# Altium schematic sheet 1_P1.schdoc
size 426 x 304 mm; Symbol: Sheet-Symbol_A3; Device: Sheet-Symbol_A3; Convert to PCB: yes; Add into BOM: yes; @Project Name: Catch5Yeah; @Page Count: 1; @Update Date: 2021-12-23; @Create Date: 2021-12-23; @Schematic Name: Schematic2; Company: 深圳嘉立创科技发展有限公司; Drawed: 嘉立创EDA; Reviewed: 嘉立创EDA; Version: V0.1; Page Size: A3; Part Number: JLCPCB-001; @Page No: 1
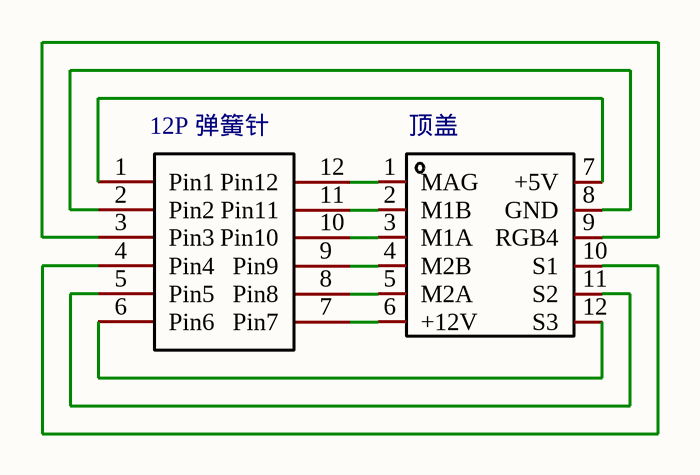
[diagram p0: 1_P1.schdoc]

## Parts
CN1  顶盖  [CONN-TH_12P-P2.00_PHD-2X6P]
U1  12P 弹簧针  [12P 弹簧针]

## Nets
NetCN1_1: CN1.1(MAG) U1.12(Pin12)
NetCN1_2: CN1.2(M1B) U1.11(Pin11)
NetCN1_3: CN1.3(M1A) U1.10(Pin10)
NetCN1_4: CN1.4(M2B) U1.9(Pin9)
NetCN1_5: CN1.5(M2A) U1.8(Pin8)
NetCN1_6: CN1.6(+12V) U1.7(Pin7)
NetCN1_7: CN1.7(+5V) U1.1(Pin1)
NetCN1_8: CN1.8(GND) U1.2(Pin2)
NetCN1_9: CN1.9(RGB4) U1.3(Pin3)
NetCN1_10: CN1.10(S1) U1.4(Pin4)
NetCN1_11: CN1.11(S2) U1.5(Pin5)
NetCN1_12: CN1.12(S3) U1.6(Pin6)

## Notes on the sheet
- 1
- 2
- 3
- 4
- 5
- 6
- A
- B
- C
- Schematic
- Schematic2
- Create Date
- Update Date
- 2021-12-23
- D
- Reviewed
- Drawed
- 嘉立创EDA
- Part Number
- Catch5Yeah
- JLCPCB-001
- VER
- SIZE
- PAGE
- OF
- V0.1
- A3
- 深圳嘉立创科技发展有限公司

## Library data of the parts
CN1 = 顶盖: 系列:PHD;连接器类型:接头;触头类型:公形引脚;间距:0.079; Manufacturer: BOOMELE(博穆精密); Manufacturer Part: PHD-2*6A; Symbol: PHD-2x6A; Add into BOM: yes; Connector Type: 接头; Pitch: 0.079; Number of Positions: 12; Device: 顶盖; LCSC Part Name: PHD-2*6P ，12P，间距2.0mm 直针; Supplier Part: C58103; LCSC Stock: 1150; LCSC On Sale: 1; Supplier Footprint: 插件; Price: 0.35; JLCPCB Part Class: Extended Part; JLCPCB Stock: 1270; JLCPCB On Sale: 1; Datasheet: https://atta.szlcsc.com/upload/public/pdf/source/20151126/1457707591005.pdf; Supplier: LCSC; Convert to PCB: yes; Series: PHD; Contact Type: 公形引脚; Number of Rows: 2; Row Spacing: 0.079; Mounting Type: 通孔; Contact Material: 磷青铜
U1 = 12P 弹簧针: Convert to PCB: yes; Symbol: 12P 弹簧针; Device: 12P 弹簧针; Add into BOM: yes